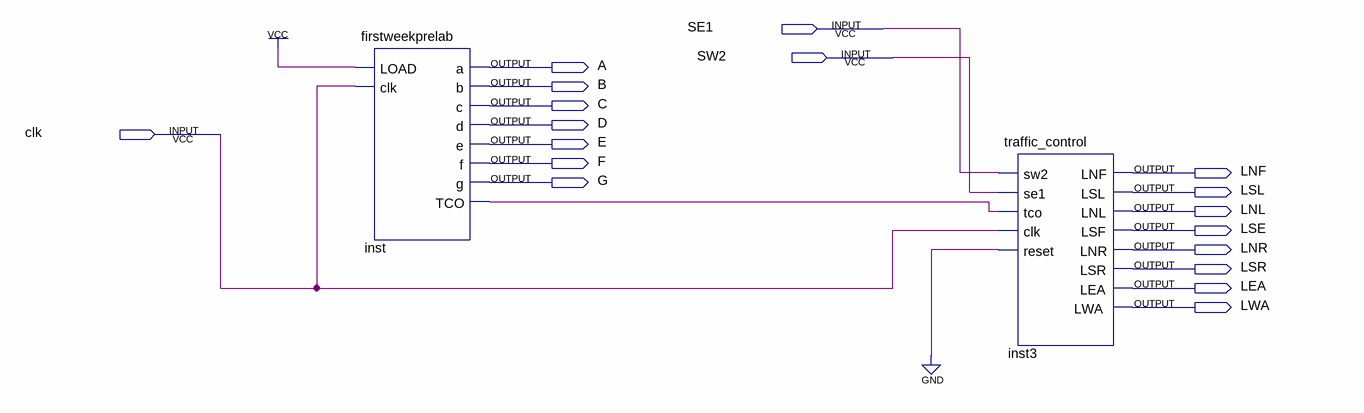
[diagram p0: schematic sheet]
// Quartus schematic exp3.bdf as structural Verilog: 2 symbols, 18 pins
module exp3 (
  input  SE1,
  input  SW2,
  input  clk,
  output A,
  output B,
  output C,
  output D,
  output E,
  output F,
  output LNF,
  output G,
  output LSL,
  output LNL,
  output LSE,
  output LNR,
  output LSR,
  output LEA,
  output LWA
);

  wire inst_tco;

  firstweekprelab inst (.LOAD(1'b1), .clk(clk), .a(A), .b(B), .c(C), .d(D), .e(E), .f(F), .g(G), .TCO(inst_tco));
  traffic_control inst3 (
    .sw2(SE1), .se1(SW2), .tco(inst_tco), .clk(clk), .reset(1'b0), .LNF(LNF), .LSL(LSL), .LNL(LNL),
    .LSF(LSE), .LNR(LNR), .LSR(LSR), .LEA(LEA), .LWA(LWA));
endmodule
